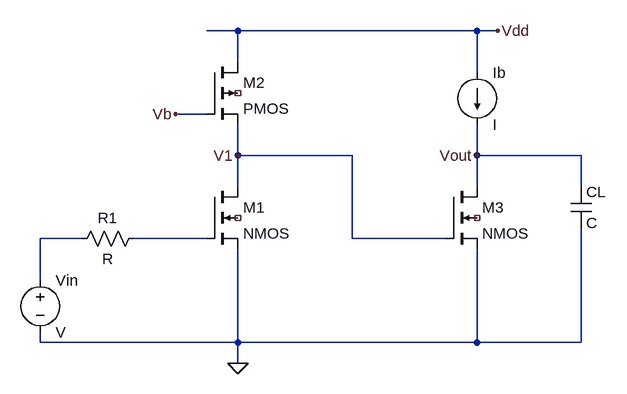
[diagram p0: schematic q1.asc]
q1.asc, the LTspice schematic file:
Version 4
SHEET 1 880 680
WIRE 256 -208 208 -208
WIRE 624 -208 256 -208
WIRE 656 -208 624 -208
WIRE 256 -160 256 -208
WIRE 624 -144 624 -208
WIRE 208 -80 160 -80
WIRE 256 -16 256 -64
WIRE 432 -16 256 -16
WIRE 624 -16 624 -64
WIRE 784 -16 624 -16
WIRE 256 32 256 -16
WIRE 624 32 624 -16
WIRE 784 32 784 -16
WIRE 16 112 -48 112
WIRE 208 112 96 112
WIRE 432 112 432 -16
WIRE 576 112 432 112
WIRE -48 176 -48 112
WIRE -48 272 -48 256
WIRE 256 272 256 128
WIRE 256 272 -48 272
WIRE 624 272 624 128
WIRE 624 272 256 272
WIRE 784 272 784 96
WIRE 784 272 624 272
WIRE 256 304 256 272
FLAG 160 -80 Vb
FLAG 656 -208 Vdd
FLAG 624 -16 Vout
FLAG 256 -16 V1
FLAG 256 304 0
SYMBOL voltage -48 160 R0
SYMATTR InstName Vin
SYMBOL res 112 96 R90
WINDOW 0 0 56 VBottom 2
WINDOW 3 32 56 VTop 2
SYMATTR InstName R1
SYMBOL nmos4 208 32 R0
SYMATTR InstName M1
SYMBOL nmos4 576 32 R0
SYMATTR InstName M3
SYMBOL pmos4 208 -160 R0
SYMATTR InstName M2
SYMBOL current 624 -144 R0
SYMATTR InstName Ib
SYMBOL cap 768 32 R0
SYMATTR InstName CL

The netlist it stands for:
* q1.asc
Vin N001 0 V
R1 N002 N001 R
M1 V1 N002 0 NC_01 NMOS
M3 Vout V1 0 NC_02 NMOS
M2 Vdd Vb V1 NC_03 PMOS
Ib Vdd Vout I
CL Vout 0 C
.model NMOS NMOS
.model PMOS PMOS
.lib standard.mos
.backanno
.end